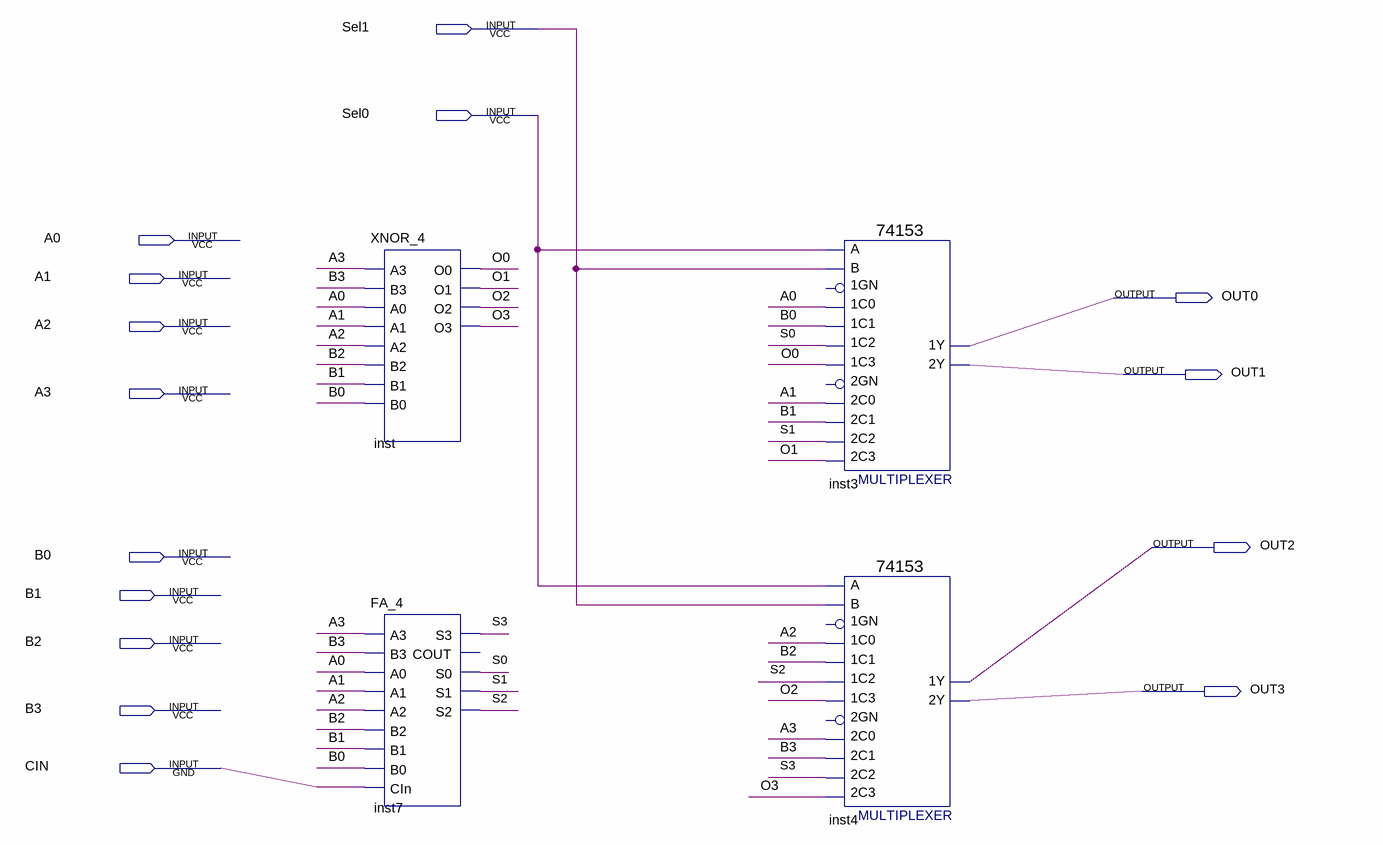
[diagram p0: schematic sheet]
// Quartus schematic ALU.bdf as structural Verilog: 4 symbols, 15 pins
module ALU (
  input  Sel1,
  input  Sel0,
  input  A0,
  input  A1,
  input  A2,
  input  A3,
  input  B0,
  input  B1,
  input  B2,
  input  B3,
  input  CIN,
  output OUT0,
  output OUT1,
  output OUT2,
  output OUT3
);

  wire O0, O1, O2, O3, S0, S1, S2, S3;

  XNOR_4 inst (
    .A3(A3), .B3(B3), .A0(A0), .A1(A1), .A2(A2), .B2(B2), .B1(B1), .B0(B0), .O0(O0), .O1(O1), .O2(O2), .O3(O3));
  FA_4 inst7 (
    .A3(A3), .B3(B3), .A0(A0), .A1(A1), .A2(A2), .B2(B2), .B1(B1), .B0(B0), .CIn(CIN), .S3(S3), .S0(S0),
    .S1(S1), .S2(S2));  // open: COUT
  \74153  inst3 (
    .\1C1 (B0), .\1C0 (A0), .\2C0 (A1), .\2C2 (S1), .\1C2 (S0), .\1C3 (O0), .B(Sel1), .A(Sel0), .\2C1 (B1),
    .\2C3 (O1), .\1Y (OUT0), .\2Y (OUT1));  // open: 1GN, 2GN
  \74153  inst4 (
    .\1C1 (B2), .\1C0 (A2), .\2C0 (A3), .\2C2 (S3), .\1C2 (S2), .\1C3 (O2), .B(Sel1), .A(Sel0), .\2C1 (B3),
    .\2C3 (O3), .\1Y (OUT2), .\2Y (OUT3));  // open: 1GN, 2GN
endmodule
